# EAGLE design LMG1025_Flasher_Shield (EAGLE 9.6.0)

## Sheet 1 of 2
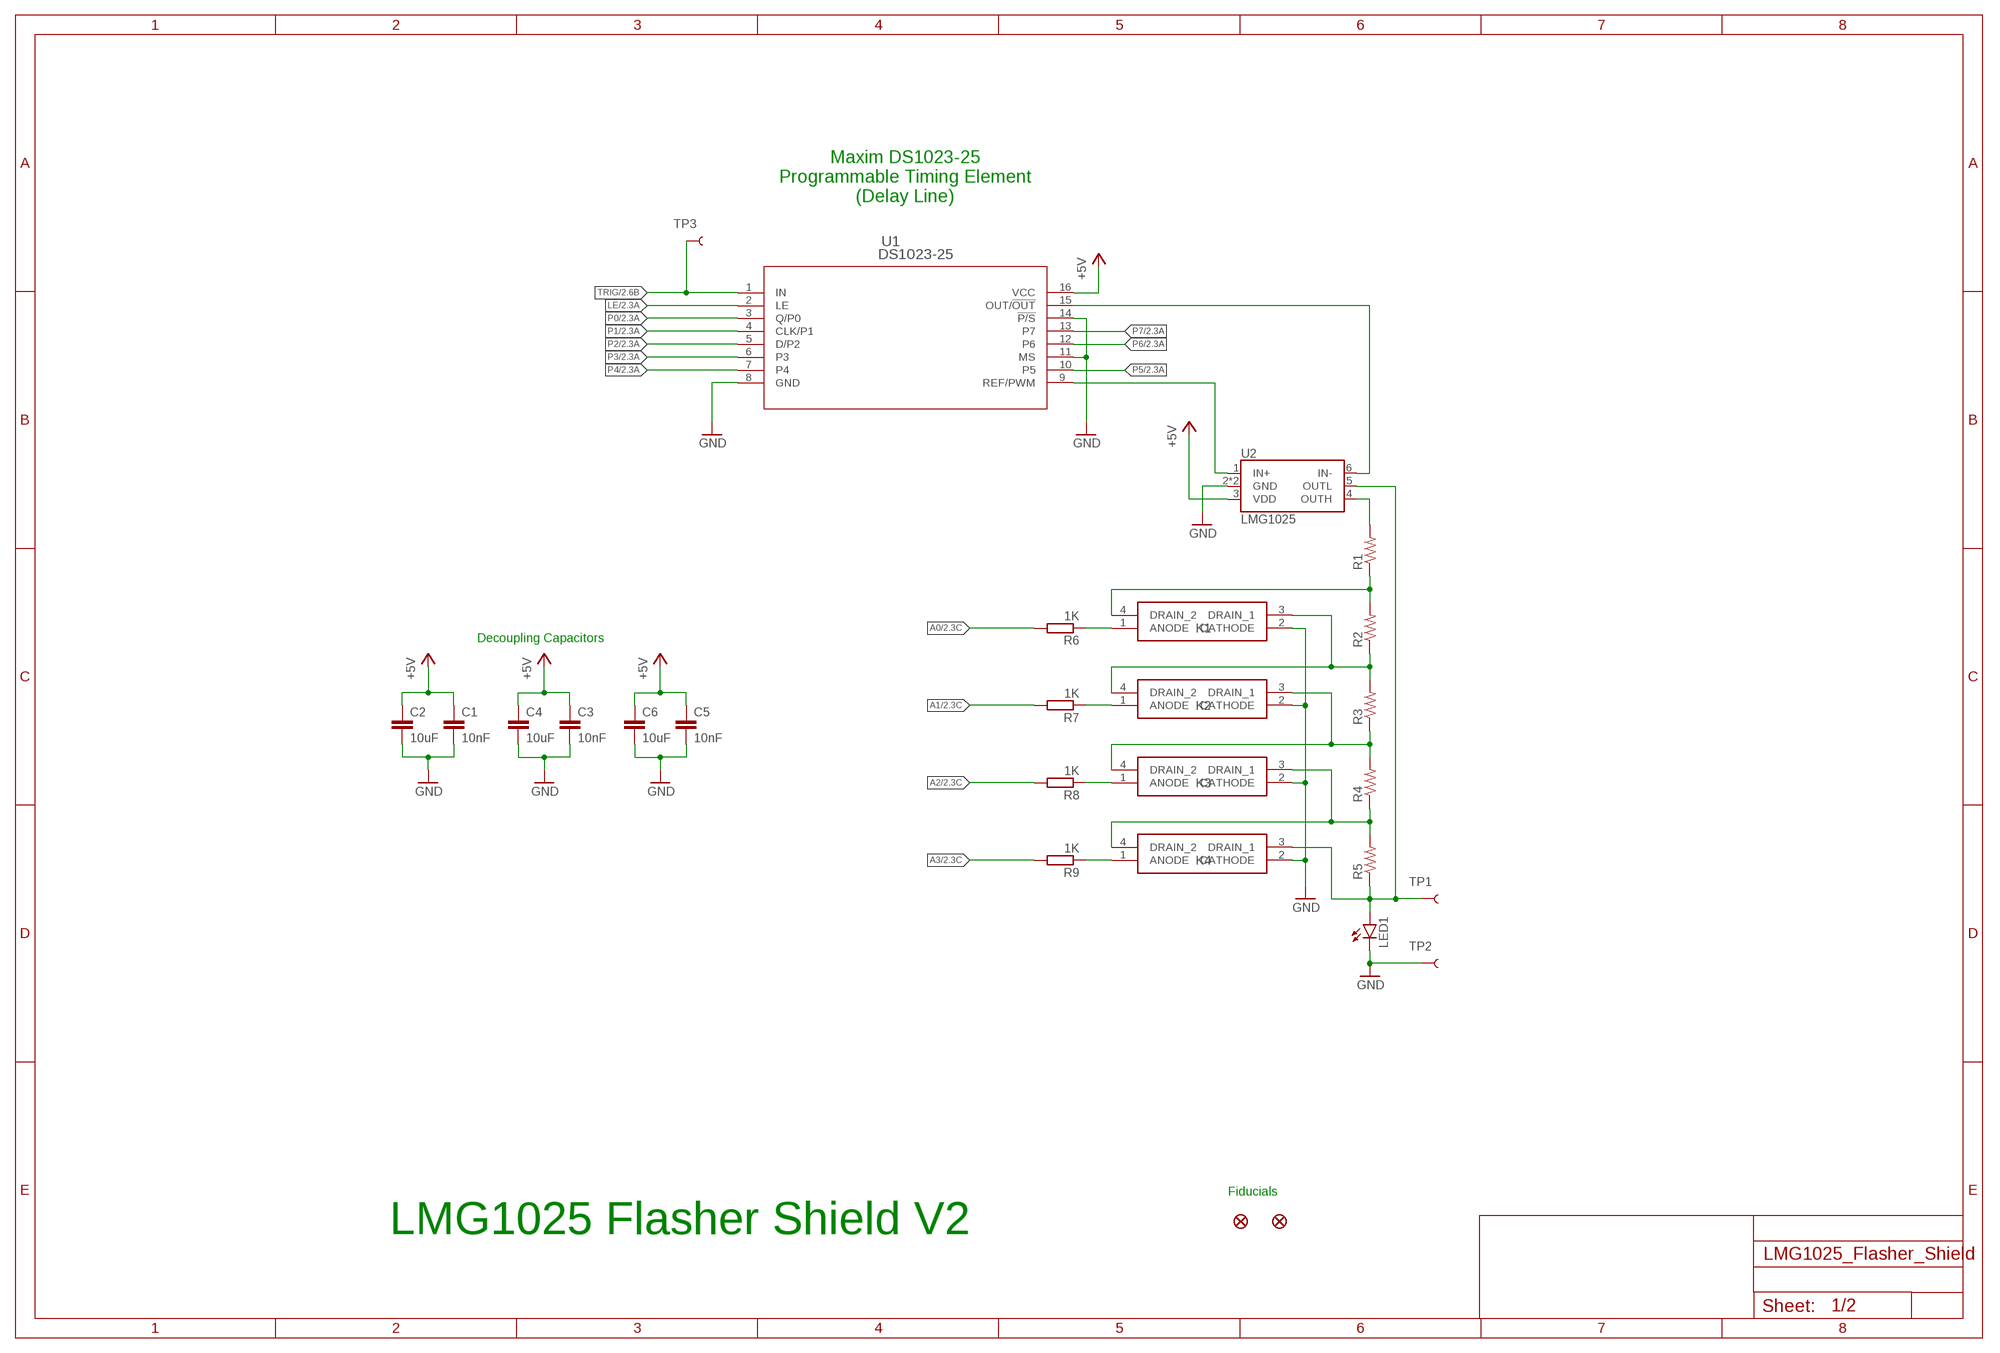
[diagram p0: schematic, sheet 1]

### Parts
C1  10nF  C-EUC0805  [C0805]
C2  10uF  C-EUC0805  [C0805]
C3  10nF  C-EUC0805  [C0805]
C4  10uF  C-EUC0805  [C0805]
C5  10nF  C-EUC0805  [C0805]
C6  10uF  C-EUC0805  [C0805]
FD1  FIDUCIAL1X2  [FIDUCIAL-1X2]
FD2  FIDUCIAL1X2  [FIDUCIAL-1X2]
K1  TLP3475R(TP,F  [TLP3475RTPF]
K2  TLP3475R(TP,F  [TLP3475RTPF]
K3  TLP3475R(TP,F  [TLP3475RTPF]
K4  TLP3475R(TP,F  [TLP3475RTPF]
LED1  LED3MM  [LED3MM]
R1  RESISTOR0805-RES  [0805]
R2  RESISTOR0805-RES  [0805]
R3  RESISTOR0805-RES  [0805]
R4  RESISTOR0805-RES  [0805]
R5  RESISTOR0805-RES  [0805]
R6  1K  R-EU_R0603  [R0603]
R7  1K  R-EU_R0603  [R0603]
R8  1K  R-EU_R0603  [R0603]
R9  1K  R-EU_R0603  [R0603]
TP1  TEST-POINTPOGO_PTH  [1X01_NO_SILK]
TP2  TEST-POINTPOGO_PTH  [1X01_NO_SILK]
TP3  TEST-POINTPOGO_PTH  [1X01_NO_SILK]
U1  DS1023-25  [21-0042B_16]
U2  LMG1025  [LMG1025]

### Nets
+5V: C1.1 C2.1 C3.1 C4.1 C5.1 C6.1 U1.16(VCC) U2.3(VDD) ; also sheet 2
A0: R6.2 ; also sheet 2
A1: R7.2 ; also sheet 2
A2: R8.2 ; also sheet 2
A3: R9.2 ; also sheet 2
GND: C1.2 C2.2 C3.2 C4.2 C5.2 C6.2 K1.2(CATHODE) K2.2(CATHODE) K3.2(CATHODE) K4.2(CATHODE) LED1.K(C) TP2.1 U1.8(GND) U1.11(MS) U1.14(!P/S) U2.2(GND) U2.PAD(GND) ; also sheet 2
LE: U1.2(LE) ; also sheet 2
N$1: K1.4(DRAIN_2) R1.1 R2.2
N$2: K1.3(DRAIN_1) K2.4(DRAIN_2) R2.1 R3.2
N$3: K4.3(DRAIN_1) LED1.A R5.1 TP1.1 U2.5(OUTL)
N$4: K2.3(DRAIN_1) K3.4(DRAIN_2) R3.1 R4.2
N$5: K3.3(DRAIN_1) K4.4(DRAIN_2) R4.1 R5.2
N$6: R1.2 U2.4(OUTH)
N$7: K1.1(ANODE) R6.1
N$8: K2.1(ANODE) R7.1
N$9: K3.1(ANODE) R8.1
N$10: K4.1(ANODE) R9.1
N$27: U1.9(REF/PWM) U2.1(IN+)
N$30: U1.15(OUT/!OUT) U2.6(IN-)
P0: U1.3(Q/P0) ; also sheet 2
P1: U1.4(CLK/P1) ; also sheet 2
P2: U1.5(D/P2) ; also sheet 2
P3: U1.6(P3) ; also sheet 2
P4: U1.7(P4) ; also sheet 2
P5: U1.10(P5) ; also sheet 2
P6: U1.12(P6) ; also sheet 2
P7: U1.13(P7) ; also sheet 2
TRIG: TP3.1 U1.1(IN) ; also sheet 2

### Notes on the sheet
- Maxim DS1023-25
  Programmable Timing Element
  (Delay Line)
- Decoupling Capacitors
- Fiducials
- LMG1025 Flasher Shield V2

## Sheet 2 of 2
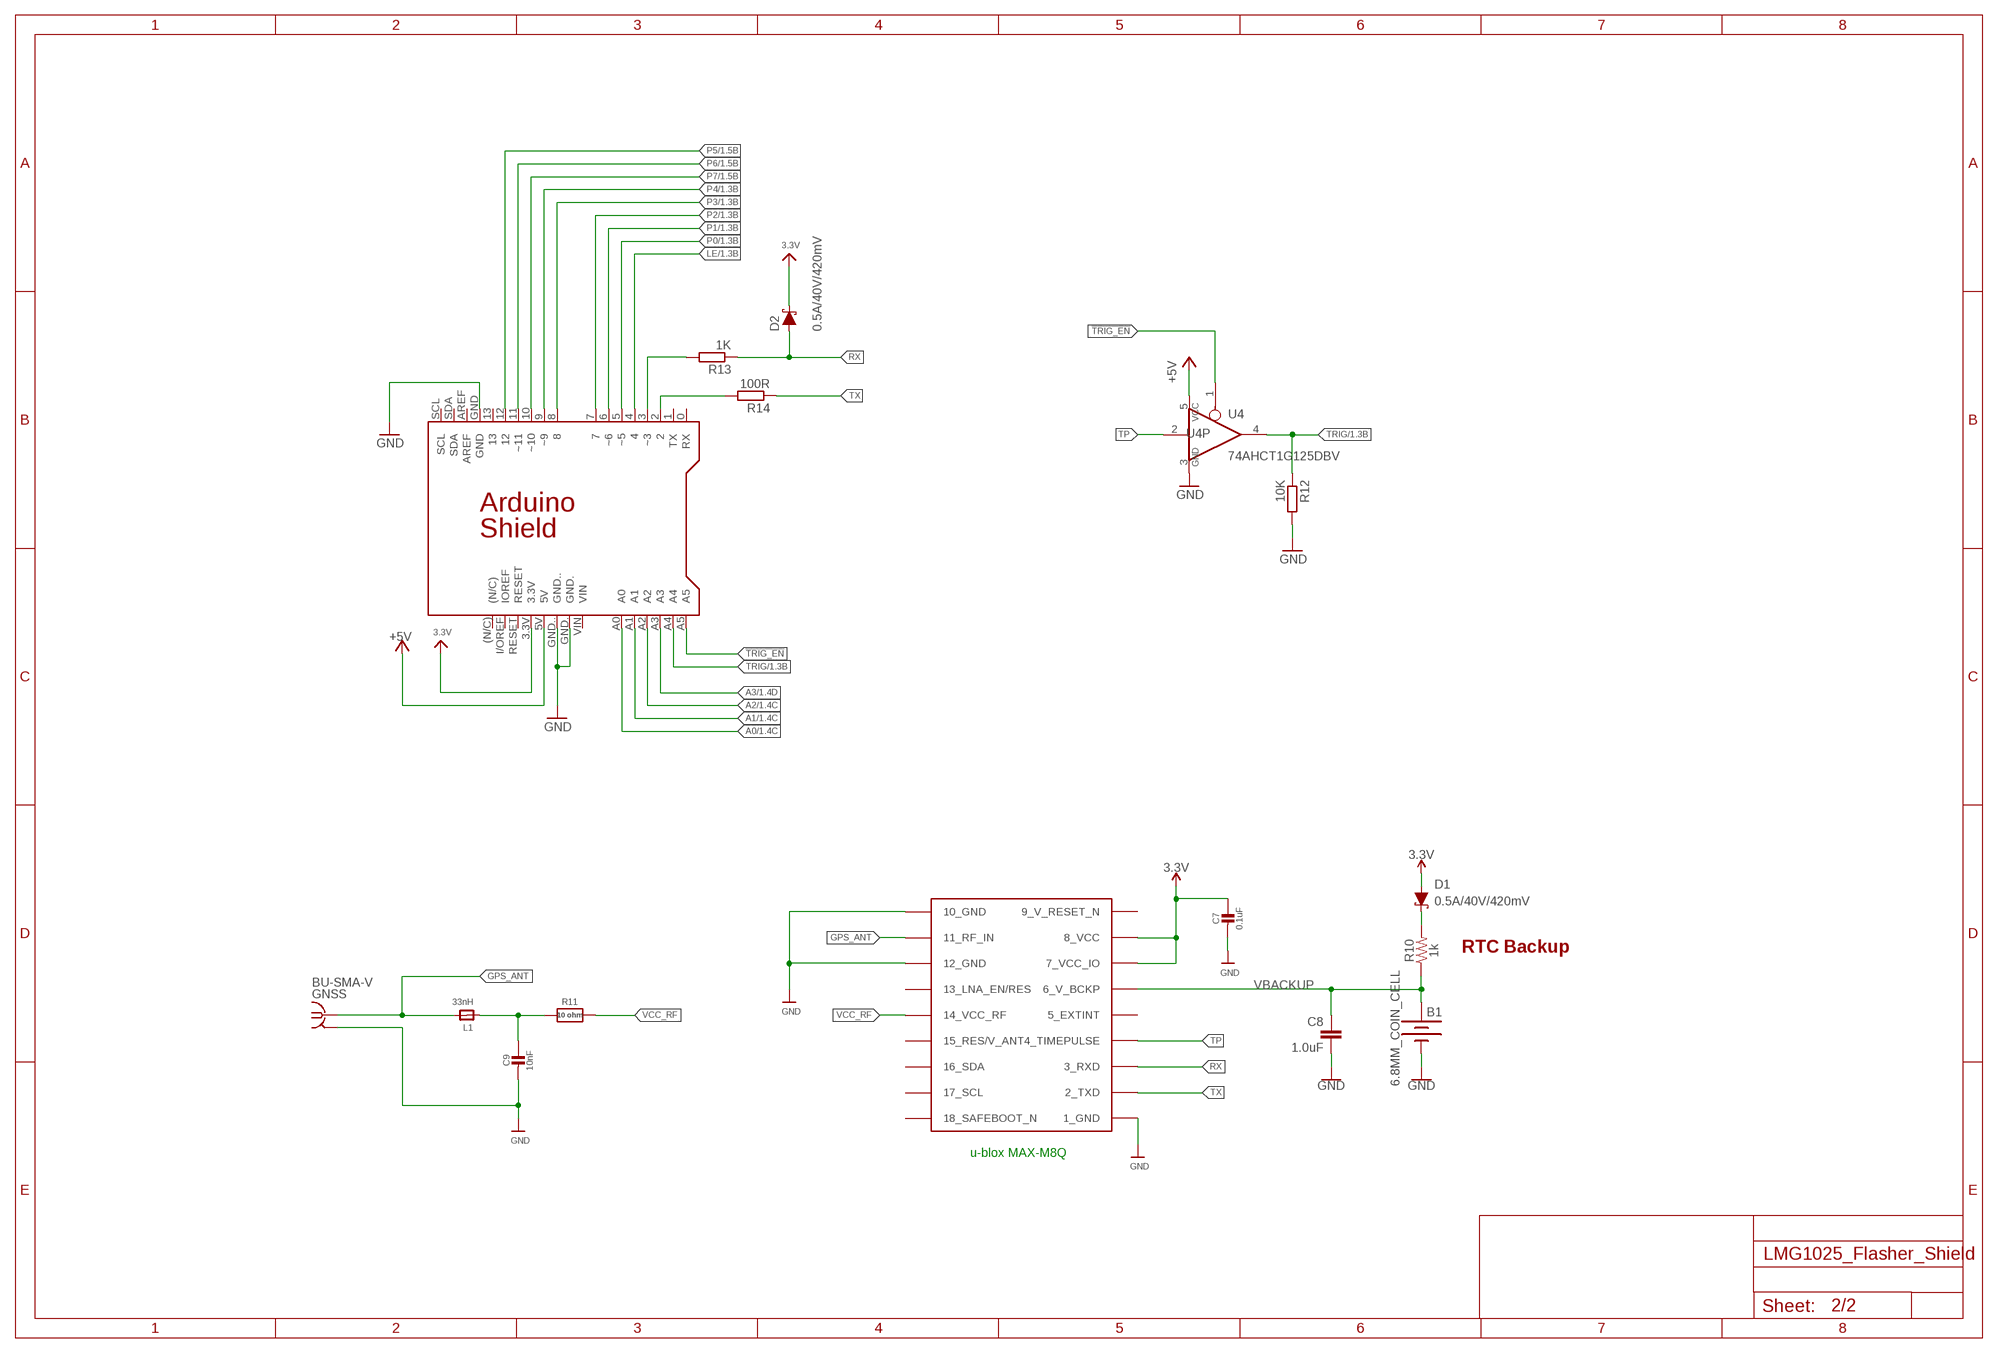
[diagram p1: schematic, sheet 2]

### Parts
B1  6.8MM_COIN_CELL  BATTERY-6.8MM_SMD  [BATTCON-6.8MM]
C7  0.1uF  CAP_CERAMIC0805-NOOUTLINE  [0805-NO]
C8  1.0uF  1.0UF-0603-16V-10%  [0603]
C9  10nF  CAP_CERAMIC0805-NOOUTLINE  [0805-NO]
D1  0.5A/40V/420mV  DIODE-SCHOTTKY-PMEG4005EJ  [SOD-323]
D2  0.5A/40V/420mV  DIODE-SCHOTTKY-PMEG4005EJ  [SOD-323]
GNSS  BU-SMA-V  [BU-SMA-V]
L1  33nH  FERRITE-0805NO  [0805-NO]
PCB1  CHEC_LED_DRIVER_SHIELD  [CHEC_LED_DRIVER_SHIELD]
R10  1k  1KOHM-0603-1/10W-1%  [0603@1]
R11  10 ohm  RESISTOR0805_NOOUTLINE  [0805-NO]
R12  10K  R-EU_R0603  [R0603]
R13  1K  R-EU_R0603  [R0603]
R14  100R  R-EU_R0603  [R0603]
U3  MAX-M8  [MAX-M8]
U4  74AHCT1G125DBV  [SOT23-5]

### Nets
3.3V: C7.1 D1.A D2.C PCB1.3.3V U3.7_VCC_IO U3.8_VCC
!TRIG_EN: PCB1.A5 U4.1(OE)
+5V: PCB1.5V U4.5(VCC) ; also sheet 1
A0: PCB1.A0 ; also sheet 1
A1: PCB1.A1 ; also sheet 1
A2: PCB1.A2 ; also sheet 1
A3: PCB1.A3 ; also sheet 1
GND: B1.- C7.2 C8.2 C9.2 GNSS.2 GNSS.3 GNSS.4 GNSS.5 PCB1.GND PCB1.GND. PCB1.GND.. R12.2 U3.1_GND U3.10_GND U3.12_GND U4.3(GND) ; also sheet 1
GPS_ANT: GNSS.1 L1.2 U3.11_RF_IN
LE: PCB1.4 ; also sheet 1
N$14: PCB1.3(~3) R13.2
N$15: C9.1 L1.1 R11.1
N$18: D1.C R10.2
N$21: PCB1.2 R14.2
P0: PCB1.5(~5) ; also sheet 1
P1: PCB1.6(~6) ; also sheet 1
P2: PCB1.7 ; also sheet 1
P3: PCB1.8 ; also sheet 1
P4: PCB1.9(~9) ; also sheet 1
P5: PCB1.12 ; also sheet 1
P6: PCB1.11(~11) ; also sheet 1
P7: PCB1.10(~10) ; also sheet 1
RX: D2.A R13.1 U3.3_RXD
TP: U3.4_TIMEPULSE U4.2(I)
TRIG: PCB1.A4 R12.1 U4.4(O) ; also sheet 1
TX: R14.1 U3.2_TXD
VBACKUP: B1.+ C8.1 R10.1 U3.6_V_BCKP
VCC_RF: R11.2 U3.14_VCC_RF
Unconnected: PCB1.0(RX) PCB1.1(TX) PCB1.13 PCB1.(N/C) PCB1.AREF PCB1.I/OREF(IOREF) PCB1.RESET PCB1.SCL PCB1.SDA PCB1.VIN U3.5_EXTINT U3.13_LNA_EN(13_LNA_EN/RES) U3.15_V_ANT/RESERVED(15_RES/V_ANT) U3.16_SDA U3.17_SCL U3.18_SAFEBOOT_N

### Notes on the sheet
- RTC Backup
- u-blox MAX-M8Q

## Power pins joined to a net without a drawn wire
9_V_RESET_N: U3.9_RESET_N(9_V_RESET_N)

## Library data of the parts
B1 = SparkFun-Batteries:BATTERY: Battery - Single Cell A variety of battery chemistries, sizes, and footprints. Device List: 20MM_PTH - Coin Cell Battery Holder - 20mm (PTH) <https://www.sparkfun.com/products/783> 20MM_PTH_KIT- Coin Cell battery Holder - 20 mm (PTH) <http://www.sparkfun.com/products/783>kit version with special mask 6.8MM_PTH - Coin Cell Battery Holder - 6.8MM(SMD) <https://www.digikey.com/product-detail/en/seiko-instruments/MS621FE-FL11E/728-1057-ND/1889208?WT.srch=1&gclid=CNOQ5a6LzdQCFZS2wAodXCkE0g> 12MM_SMD - Coin Cell Battery Holder - 12mm (SMD) <https://www.sparkfun.com/products/10592> 12MM_PTH - Coin Cell Battery Holder - 12mm (PTH) <https://www.sparkfun.com/products/7948> 20MM_SMD - 20mm Coin Cell Battery Holder (SMD) (2 legs) Used on the Big Time Watch Kit <https://www.sparkfun.com/products/11734> 20MM_SMD_4LEGS - Coin Cell Battery Holder - 20mm (SMD) <https://www.sparkfun.com/products/11892> 20MM_SMD_4LEGS_OVERPASTE - Coin Cell Battery Holder - 20mm (SMD) <https://www.sparkfun.com/products/11892> (Over-paste on the legs) 24.5MM_PTH - Coin Cell Battery Holder - 24.5mm (PTH) <https://www.sparkfun.com/products/8863> 9V - 9V Battery Holder - PC Mount Used on the SparkFun SparkPunk Sound Kit <https://www.sparkfun.com/products/11177> and SparkFun SparkPunk Sequencer Kit <https://www.sparkfun.com/products/12707> 18650 - Battery Holder - 18650 (PTH) <https://www.sparkfun.com/products/13113> AA - Battery Holder - 1xAA (PTH) <https://www.sparkfun.com/products/7949> AAA - Battery Holder - 1xAAA (PTH) <https://www.sparkfun.com/products/12718> AA_KIT - Battery Holder - 1xAA (PTH) <https://www.sparkfun.com/products/7949> Special kit package - pads only have exposed copper on one side of the board. AAA_KIT - Battery Holder - 1xAAA (PTH) <https://www.sparkfun.com/products/12718> Special kit package - pads only have exposed copper on one side of the board.; PROD_ID: BATT-13734
C1-C6 = rcl:C-EU: CAPACITOR, European symbol; SPICEPREFIX: C
C7 C9 = microbuilder:CAP_CERAMIC: Ceramic Capacitors For new designs, use the packages preceded by an '_' character since they are more reliable: The following footprints should be used on most boards: _0402 - Standard footprint for regular board layouts _0603 - Standard footprint for regular board layouts _0805 - Standard footprint for regular board layouts _1206 - Standard footprint for regular board layouts For extremely tight-pitch boards where space is at a premium, the following 'micro-pitch' footprints can be used (smaller pads, no silkscreen outline, etc.): _0402MP - Micro-pitch footprint for very dense/compact boards _0603MP - Micro-pitch footprint for very dense/compact boards _0805MP - Micro-pitch footprint for very dense/compact boards _1206MP - Micro-pitch footprint for very dense/compact boards
C8 = SparkFun-Capacitors:1.0UF: 1µF ceramic capacitors A capacitor is a passive two-terminal electrical component used to store electrical energy temporarily in an electric field.; PROD_ID: CAP-00868
D1 D2 = SparkFun-DiscreteSemi:DIODE-SCHOTTKY: Schottky diode A Schottky diode is a semiconductor diode which has a low forward voltage drop and a very fast switching action.; PROD_ID: DIO-10955
FD1 FD2 = SparkFun-Aesthetics:FIDUCIAL: Fiducial Alignment Points Various fiducial points for machine vision alignment.
GNSS = con-coax:BU-SMA-V: FEMALE SMA CONNECTOR Radiall distributor RS 112-3794; OC_FARNELL: unknown; OC_NEWARK: unknown
K1-K4 = SamacSys_Parts:TLP3475R(TP,F: Solid State Relays - PCB Mount Photo-IC 3mA 50V 5000Vrms Source: Datasheet <http://toshiba.semicon-storage.com/info/docget.jsp?did=55304&prodName=TLP3475R>; DESCRIPTION: Solid State Relays - PCB Mount Photo-IC 3mA 50V 5000Vrms; HEIGHT: 1mm; MANUFACTURER_NAME: Toshiba; MANUFACTURER_PART_NUMBER: TLP3475R(TP,F; MOUSER_PART_NUMBER: 757-TLP3475RTPF; MOUSER_PRICE-STOCK: https://www.mouser.com/Search/Refine.aspx?Keyword=757-TLP3475RTPF
L1 = microbuilder:FERRITE: Ferrite Bead 0603 MMZ1608B121C - 120 Ohm @ 100MHz, 600mA, 0.15 Ohm DC Resistance - Digikey: 445-2164-1-ND BK1608HW121-T - 120 Ohm, 600mA Ferrite Chip - Digikey: 587-1876-2-ND 0805 HZ0805B272R-10 - 2.7K Ohm @ 100MHz, 200mA, 0.8 Ohm DC Resistance - Digikey: 240-2504-1-ND (see also Murata BLM21BD272SN1L) MMZ2012Y152B - 1.5K Ohm @ 100MHz, 500mA, 0.4 Ohm DC Resistance - Digikey: 445-1560-1-ND - Mainly for high frequency (80-400MHz) MMZ2012R102A - 1K Ohm @ 100MHz, 500mA, 0.3 Ohm DC Resistance - Digikey: 445-1555-2-ND - More general purpose (10-200MHz)
LED1 = SparkFun-LED:LED: LEDs Standard schematic elements and footprints for 5mm, 3mm, 1206, and 0603 sized LEDs. 5mm - Spark Fun Electronics SKU : COM-00529 (and others); PROD_ID: DIO-08794
PCB1 = LMG1025_Flasher_Shield:CHEC_LED_DRIVER_SHIELD: CHEC LED Driver Shield for Arduino Leonardo Ethernet
R1-R5 = SparkFun-Resistors:RESISTOR: Resistor Basic schematic elements and footprints for 0603, 1206, and PTH resistors.
R6-R9 R12-R14 = resistor:R-EU_: RESISTOR, European symbol
R10 = SparkFun-Resistors:1KOHM: 1kΩ resistor A resistor is a passive two-terminal electrical component that implements electrical resistance as a circuit element. Resistors act to reduce current flow, and, at the same time, act to lower voltage levels within circuits. - Wikipedia; PROD_ID: RES-07856
R11 = microbuilder:RESISTOR: Resistors For new designs, use the packages preceded by an '_' character since they are more reliable: The following footprints should be used on most boards: _0402 - Standard footprint for regular board layouts _0603 - Standard footprint for regular board layouts _0805 - Standard footprint for regular board layouts _1206 - Standard footprint for regular board layouts For extremely tight-pitch boards where space is at a premium, the following 'micro-pitch' footprints can be used (smaller pads, no silkscreen outline, etc.): _0402MP - Micro-pitch footprint for very dense/compact boards _0603MP - Micro-pitch footprint for very dense/compact boards _0805MP - Micro-pitch footprint for very dense/compact boards _1206MP - Micro-pitch footprint for very dense/compact boards
TP1-TP3 = SparkFun-Connectors:TEST-POINT: SparkFun Test Points Bare copper test points for troubleshooting or In-Circuit-Testing. These are used by our Production team for verifying production board runs using pogo-pins on test beds. SparkFun Products: SparkFun LSM9DS1 Breakout <https://www.sparkfun.com/products/13284> SparkFun PSOC <https://www.sparkfun.com/products/13714> SparkFun Load Cell Amplifier <https://www.sparkfun.com/products/13879>
U1 = DS1023:DS1023-25; MANUFACTURER_PART_NUMBER: DS102325; VENDOR: MAXIM
U2 = LMG1025:LMG1025: Texas Instruments LMG1025-Q1 Automotive Low Side GaN and MOSFET Driver For High Frequency and Narrow Pulse Applications
U3 = ubloxLib:MAX-M8: u-blox MAX GNSS module
U4 = 74xx-little-us:74*1G125: Single Bus Buffer Gate with 3-State Output

## Board
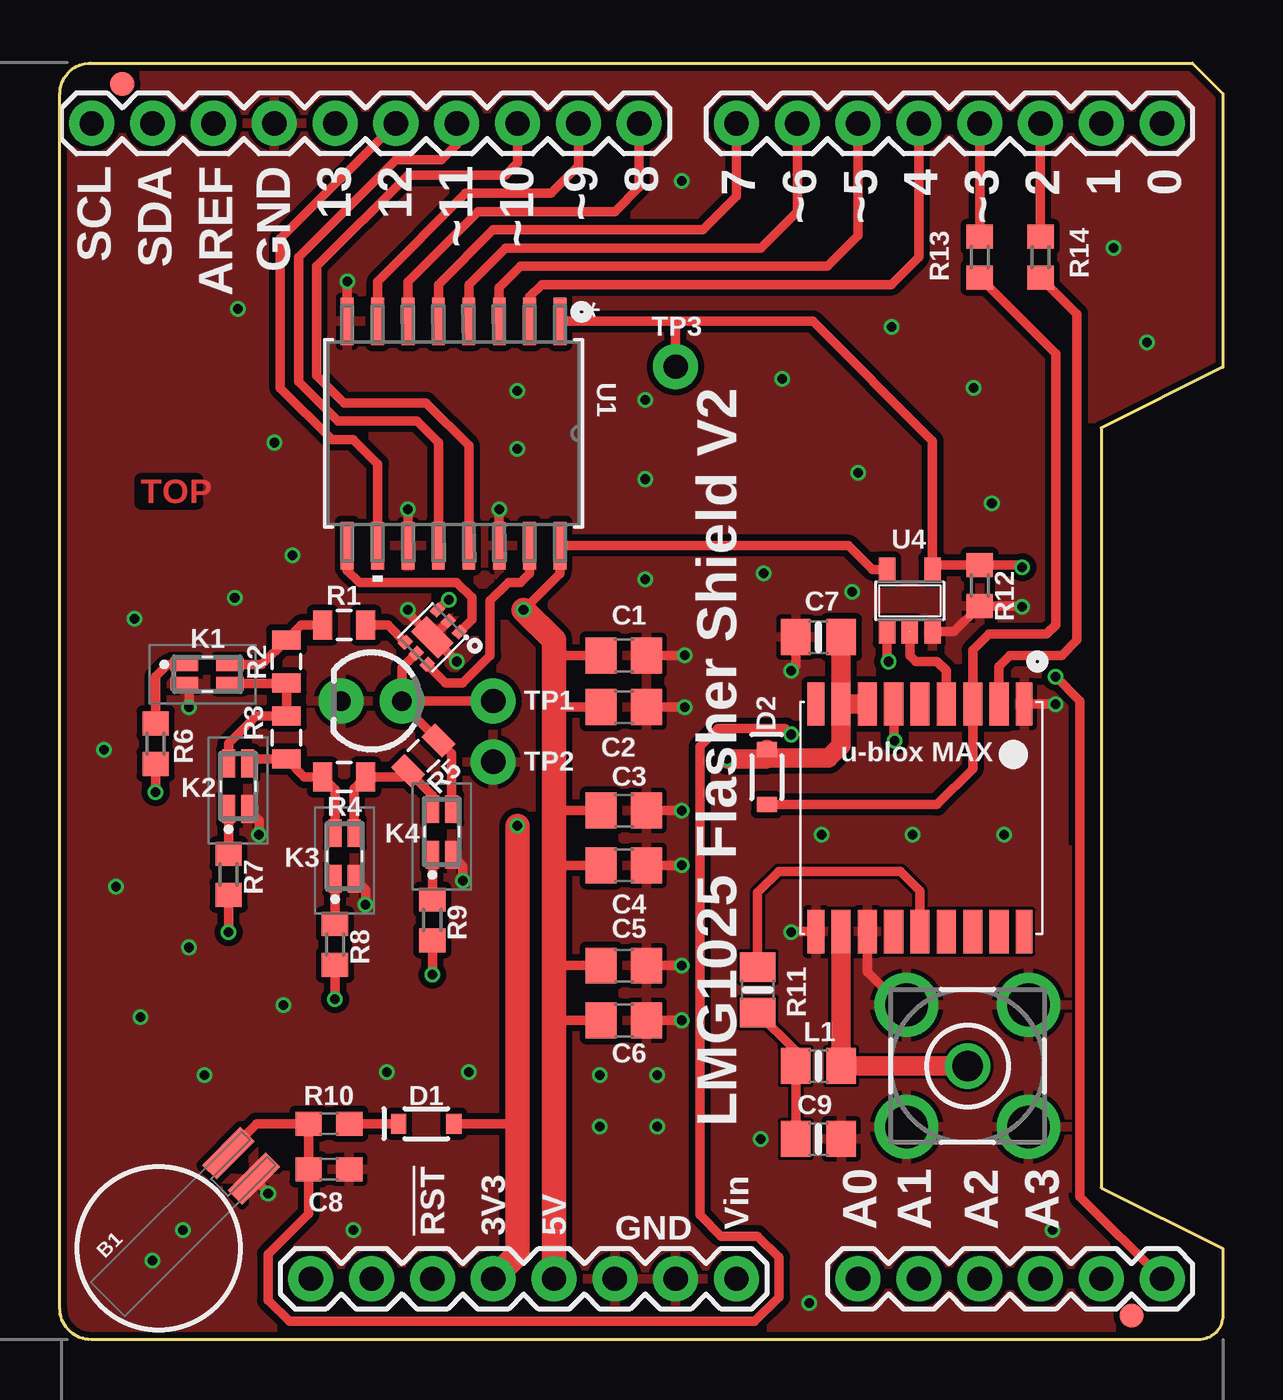
[diagram p2: board, top side]
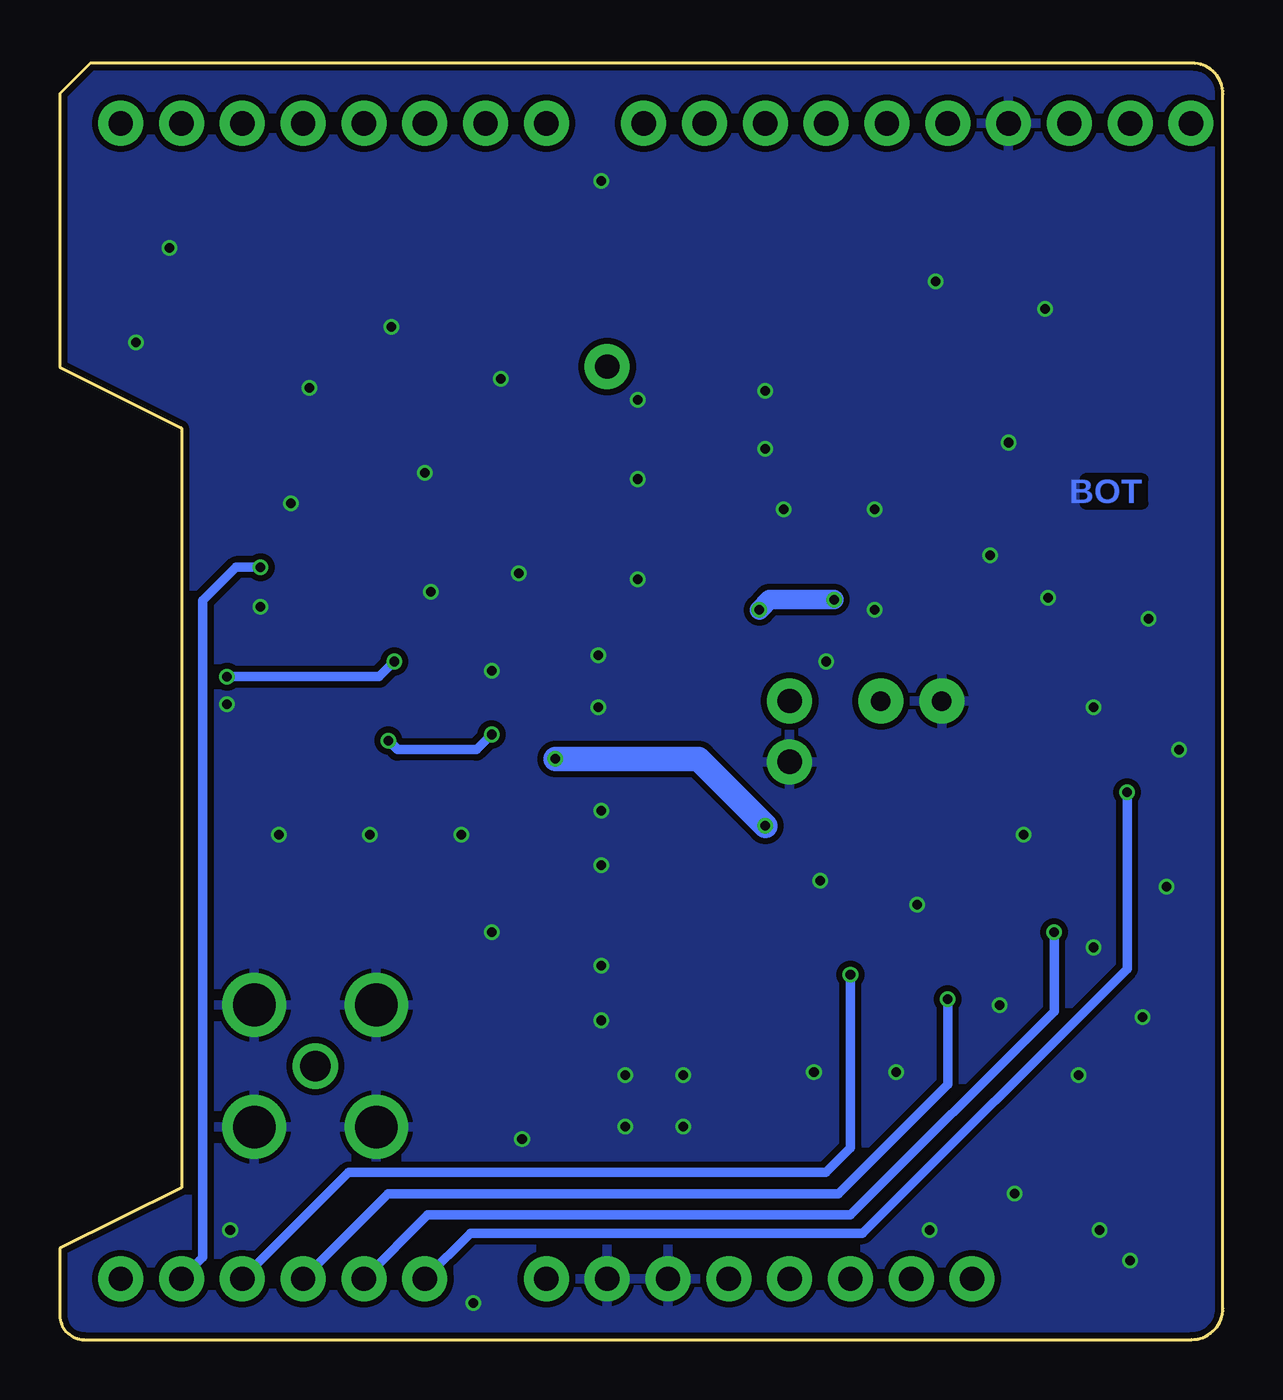
[diagram p3: board, bottom side, seen from below]

Size 48.58 x 53.31 mm. Coordinates in mm from the lower left corner, seen from the top.
Copper layers (1*16): Top 0.018mm / dielectric 1.55mm / Bottom 0.018mm
Design rules "Multi-CB_4L_125um-Tracks_OL35um-IL35um *": minimum track width 0.125mm, minimum drill 0.2mm, track to track 0.125mm, track to pad 0.125mm, pad to pad 0.125mm, via to via 0.125mm, smd to smd 0mil, copper to edge 0.2mm, drill to drill 0.2mm, minimum pad ring 0.125mm, minimum via ring 0.125mm, stop-mask expansion 2mil, vias tented up to drill 0.45mm, thermal gap 0.2mm

### Footprints (pad centres in the part's own frame; a part is rotated, then mirrored left to right if it is on the bottom)
BATTCON-6.8MM = smd 2.25 x 0.85: + 4.87,0.75; - 4.87,-0.75
C0805 = smd 1.3 x 1.5: 1 -0.95,0; 2 0.95,0
0805-NO = smd 1.24 x 1.5: 1 -0.95,0; 2 0.95,0
0603 = smd 1.1 x 1: 1 -0.85,0; 2 0.85,0
SOD-323 = smd 0.63 x 0.83: A 1.15,0; C -1.15,0
FIDUCIAL-1X2 = smd 1 x 1: 1 0,0
BU-SMA-V = drill 1.27: 1 0,0 | drill 1.778: 2 -2.55,2.55; 3 2.55,2.55; 4 2.55,-2.55; 5 -2.55,-2.55
TLP3475RTPF = smd 0.55 x 1.15: 1 0,-0.95; 2 0.8,-0.95; 3 0.8,0.95; 4 0,0.95
LED3MM = drill 0.813 pad 1.88: A -1.27,0; K 1.27,0
CHEC_LED_DRIVER_SHIELD = drill 1.016 pad 1.88: 0 45.72,50.8; 1 43.18,50.8; 2 40.64,50.8; 3 38.1,50.8; 3.3V 17.78,2.54; 4 35.56,50.8; 5 33.02,50.8; 5V 20.32,2.54; 6 30.48,50.8; 7 27.94,50.8; 8 23.876,50.8; 9 21.336,50.8; 10 18.796,50.8; 11 16.256,50.8; 12 13.716,50.8; 13 11.176,50.8; (N/C) 10.16,2.54; A0 33.02,2.54; A1 35.56,2.54; A2 38.1,2.54; A3 40.64,2.54; A4 43.18,2.54; A5 45.72,2.54; AREF 6.096,50.8; GND 8.636,50.8; GND. 25.4,2.54; GND.. 22.86,2.54; I/OREF 12.7,2.54; RESET 15.24,2.54; SCL 1.016,50.8; SDA 3.556,50.8; VIN 27.94,2.54
0805 = smd 0.8 x 1.2: 1 -0.9,0; 2 0.9,0
R0603 = smd 1 x 1.1: 1 -0.85,0; 2 0.85,0
0603@1 = smd 1.1 x 1: 1 -0.85,0; 2 0.85,0
1X01_NO_SILK = drill 1.016 pad 1.88: 1 0,0
21-0042B_16 = smd 1.981 x 0.533: 1 -4.686,4.445; 2 -4.686,3.175; 3 -4.686,1.905; 4 -4.686,0.635; 5 -4.686,-0.635; 6 -4.686,-1.905; 7 -4.686,-3.175; 8 -4.686,-4.445; 9 4.686,-4.445; 10 4.686,-3.175; 11 4.686,-1.905; 12 4.686,-0.635; 13 4.686,0.635; 14 4.686,1.905; 15 4.686,3.175; 16 4.686,4.445
LMG1025 = smd 0.4 x 0.5: 1 -0.65,-0.95; 2 0,-0.95; 3 0.65,-0.95; 4 0.65,0.95; 5 0,0.95; 6 -0.65,0.95 | smd 1.6 x 0.9: PAD 0,0
MAX-M8 = smd 1.8 x 0.7: 1_GND 4.95,-4.4; 9_RESET_N 4.95,4.3; 10_GND -4.55,4.3; 18_SAFEBOOT_N -4.55,-4.4 | smd 1.8 x 0.8: 2_TXD 4.95,-3.35; 3_RXD 4.95,-2.25; 4_TIMEPULSE 4.95,-1.15; 5_EXTINT 4.95,-0.05; 6_V_BCKP 4.95,1.05; 7_VCC_IO 4.95,2.15; 8_VCC 4.95,3.25; 11_RF_IN -4.55,3.25; 12_GND -4.55,2.15; 13_LNA_EN -4.55,1.05; 14_VCC_RF -4.55,-0.05; 15_V_ANT/RESERVED -4.55,-1.15; 16_SDA -4.55,-2.25; 17_SCL -4.55,-3.35
SOT23-5 = smd 0.69 x 0.99: 1 -0.95,-1.29; 2 0,-1.29; 3 0.95,-1.29; 4 0.95,1.3; 5 -0.95,1.3

### Placement (x,y rotation side)
B1  4.13,3.81 45 top
C1  23.56,28.57 0 top
C2  23.56,26.42 0 top
C3  23.56,22.1 0 top
C4  23.56,19.81 0 top
C5  23.56,15.62 0 top
C6  23.56,13.34 0 top
C7  31.69,29.34 180 top
C8  11.24,7.11 0 top
C9  31.69,8.38 0 top
D1  15.3,9.02 0 top
D2  29.53,23.5 270 top
FD1  2.6,52.45 0 top
FD2  44.77,1.02 0 top
GNSS  37.91,11.43 0 top
K1  6.16,28.19 270 top
K2  7.05,23.11 0 top
K3  11.49,20.19 0 top
K4  15.56,21.21 0 top
L1  31.69,11.43 0 top
LED1  13.02,26.67 180 top
PCB1  0.32,0 0 top
R1  11.87,29.84 0 top
R2  9.46,28.32 90 top
R3  9.46,25.15 90 top
R4  11.87,23.5 180 top
R5  15.18,24.38 225 top
R6  4,24.89 270 top
R7  7.05,19.43 270 top
R8  11.49,16.51 270 top
R9  15.56,17.53 270 top
R10  11.24,9.02 0 top
R11  29.15,14.61 90 top
R12  38.42,31.5 270 top
R13  38.42,45.21 90 top
R14  40.96,45.21 90 top
TP1  18.1,26.67 0 top
TP2  18.1,24.13 0 top
TP3  25.72,40.64 0 top
U1  16.45,37.85 270 top
U2  15.56,29.34 135 top
U3  35.88,21.59 90 top
U4  35.5,30.86 0 top

### Tracks (layer width: path | path; a pad name or v marks a point on that pad's centre or on a via)
3.3V  (via drill 0.4)
  Top 0.406: D1.A 19.11,9.02
  Top 0.813: v27.88,24.26 29.49,24.26 29.53,24.3 | U3.8_VCC 32.63,24.82 32.11,24.3 29.53,24.3 | U3.7_VCC_IO U3.8_VCC | C7.1 32.63,29.33 U3.8_VCC | D2.C 29.53,24.3
  Top 1.016: PCB1.3.3V 19.11,3.56 19.11,9.02 v19.11,21.46
  Bottom 1.016: v27.88,24.26 21.91,24.26 v19.11,21.46
!TRIG_EN  (via drill 0.4)
  Top 0.406: PCB1.A5 42.61,5.97 42.61,26.67 v41.59,27.69 | v34.61,28.32 34.55,28.38 U4.1
  Bottom 0.406: v41.59,27.69 35.24,27.69 v34.61,28.32
+5V  (via drill 0.4)
  Top 0.406: U4.5 33.94,32.16 32.94,33.16 U1.16 20.89,32 v19.37,30.48 | U2.3 16.21,30.91 v16.24,30.91 | C2.1 20.64,26.42 | C1.1 20.64,28.57 | C3.1 20.64,22.1 | C4.1 20.64,19.81 | C5.1 20.64,15.62 | C6.1 20.64,13.34
  Top 1.016: PCB1.5V 20.64,13.34 20.64,15.62 20.64,19.81 20.64,22.1 20.64,26.42 20.64,28.57 20.64,29.21 v19.37,30.48
  Bottom 0.813: v19.37,30.48 18.94,30.91 v16.24,30.91
A0  (via drill 0.4)
  Top 0.406: v4,22.86 R6.2
  Bottom 0.406: PCB1.A0 31.43,4.45 15.05,4.45 4,15.49 v4,22.86
A1  (via drill 0.4)
  Top 0.406: v7.05,17.02 R7.2
  Bottom 0.406: PCB1.A1 33.21,5.21 15.56,5.21 7.05,13.72 v7.05,17.02
A2  (via drill 0.4)
  Top 0.406: v11.49,14.22 R8.2
  Bottom 0.406: PCB1.A2 34.86,6.1 16.07,6.1 11.49,10.67 v11.49,14.22
A3  (via drill 0.4)
  Top 0.406: v15.56,15.24 R9.2
  Bottom 0.406: PCB1.A3 36.51,6.99 16.57,6.99 15.56,8 v15.56,15.24
GND  (via drill 0.4)
  Top 0.406: U3.12_GND 33.73,15.36 35.11,13.98 GNSS.2 | U3.10_GND 30.57,17.04 v30.54,17.02 | U3.1_GND v41.59,26.54 | v40.2,30.61 40.16,30.65 R12.2 37.34,29.57 U4.3 | B1.- 8.7,6.12 v8.7,6.1 | C7.2 30.74,28.13 v30.54,27.94 | U2.2 U2.PAD | U2.PAD 14.54,30.35 v14.54,30.48 | v14.54,34.67 U1.11 | U1.14 v18.35,34.67 | v16.57,28.32 U2.PAD | U1.8 v12,44.2 | C1.2 v26.1,28.57 | C2.2 v26.1,26.42 | K1.2 5.4,27.21 v5.4,26.42 | K2.2 8.32,21.69 v8.32,21.08 | K3.2 12.76,18.77 v12.76,18.16 | K4.2 16.83,19.79 v16.83,19.18 | v25.97,22.1 C3.2 | v25.97,19.81 C4.2 | v25.97,15.62 C5.2 | v25.97,13.34 C6.2
  other vias: 31.81,21.08 35.62,21.08 39.43,21.08 33.08,31.24 3.87,3.3 5.14,4.57 29.27,8.38 6.03,11.05 3.37,13.46 2.35,18.92 1.84,24.64 3.11,30.1 7.3,30.99 9.72,32.77 8.95,37.47 7.43,43.05 25.97,48.39 34.73,42.29 38.16,39.75 38.93,34.92 19.11,39.62 19.11,37.21 24.45,39.24 30.16,40.13 33.34,36.2 24.45,31.75 29.4,32 24.45,35.94 22.54,11.05 24.96,11.05 22.54,8.89 24.96,8.89 9.33,13.97 5.4,16.38 13.65,11.18 17.08,11.18 12.26,4.57 41.47,4.57 44.01,45.59 45.4,41.66 31.31,1.52
  pour Top (isolate 0.102): 27.62,20.45 43.5,20.45 43.5,6.35 27.62,6.35
  pour Top (isolate 0.254, rank 2): 0.06,0 0.06,53.34 47.31,53.34 48.58,52.07 48.58,40.64 43.5,38.1 43.5,6.35 48.58,3.81 48.58,0
  pour Bottom (isolate 0.254, rank 2): 0.06,0 0.06,53.34 47.31,53.34 48.58,52.07 48.58,40.64 43.5,38.1 43.5,6.35 48.58,3.81 48.58,0
GPS_ANT
  Top 0.813: GNSS.1 L1.2 U3.11_RF_IN
LE
  Top 0.406: U1.2 19.62,43.56 20.13,44.07 34.73,44.07 35.88,45.21 PCB1.4
N$1
  Top 0.406: R1.1 10.09,29.84 R2.2 8.43,28.19 K1.4
N$2
  Top 0.406: K1.3 9.43,27.39 R2.1 R3.2 8.2,26.05 7.05,24.89 K2.4
N$3
  Top 0.406: LED1.A 14.29,26.55 R5.1 16.36,24.48 K4.3 | U2.5 14.29,28.07 LED1.A | TP1.1 LED1.A
N$4
  Top 0.406: K2.3 8.03,24.25 R3.1 10.21,23.5 R4.2 11.49,22.98 K3.4
N$5
  Top 0.406: K3.3 12.29,23.01 R4.1 14.29,23.5 R5.2 15.56,22.73 K4.4
N$6
  Top 0.406: U2.4 13.71,29.84 R1.2
N$7
  Top 0.406: R6.1 4,27.69 4.51,28.19 K1.1
N$8
  Top 0.406: R7.1 K2.1
N$9
  Top 0.406: R8.1 K3.1
N$10
  Top 0.406: R9.1 K4.1
N$14
  Top 0.406: R13.2 PCB1.3
N$15
  Top 0.406: C9.1 L1.1 30.74,12.06 R11.1
N$18
  Top 0.406: D1.C R10.2
N$21
  Top 0.406: R14.2 PCB1.2
N$27
  Top 0.406: U2.1 17.21,30.07 17.21,30.99 16.57,31.62 12.51,31.62 12,32.13 U1.9
N$30
  Top 0.406: U2.6 16.12,27.43 16.83,27.43 17.97,28.57 17.97,30.86 18.73,31.62 19.24,31.62 19.62,32 U1.15
P0
  Top 0.406: U1.3 18.35,43.94 19.24,44.83 32.07,44.83 33.34,46.1 PCB1.5
P1
  Top 0.406: U1.4 17.08,44.07 18.61,45.59 29.27,45.59 30.8,47.12 PCB1.6
P2
  Top 0.406: U1.5 15.81,44.07 18.1,46.35 26.86,46.35 28.26,47.75 PCB1.7
P3
  Top 0.406: U1.6 14.54,44.2 17.46,47.12 23.18,47.12 24.19,48.13 PCB1.8
P4
  Top 0.406: U1.7 13.27,44.2 16.95,47.88 20.51,47.88 21.65,49.02 PCB1.9
P5
  Top 0.406: U1.10 13.27,36.58 12.26,37.59 11.37,37.59 9.21,39.75 9.21,45.97 PCB1.12
P6
  Top 0.406: U1.12 15.81,37.47 14.92,38.35 11.62,38.35 9.97,40.01 9.97,45.21 14.03,49.28 15.94,49.28 16.57,49.91 PCB1.11
P7
  Top 0.406: U1.13 17.08,37.34 15.3,39.12 11.87,39.12 10.73,40.26 10.73,44.83 14.54,48.64 18.61,48.64 19.11,49.15 PCB1.10
RX
  Top 0.406: R13.1 41.59,41.19 41.59,29.84 41.21,29.46 38.8,29.46 38.13,28.79 U3.3_RXD 38.13,23.84 36.63,22.34 D2.A
TP
  Top 0.406: U4.2 35.5,28.57 35.75,28.32 36.64,28.32 37.02,27.94 U3.4_TIMEPULSE
TRIG  (via drill 0.4)
  Top 0.406: U1.1 25.72,42.53 | 25.72,42.53 31.45,42.53 36.45,37.53 U4.4 36.63,32.35 R12.1 40.11,32.35 v40.2,32.26 | TP3.1 25.72,42.53
  Bottom 0.406: v40.2,32.26 41.21,32.26 42.61,30.86 42.61,3.43 PCB1.A4
TX
  Top 0.406: R14.1 42.48,42.84 42.48,29.21 41.85,28.57 39.69,28.57 39.23,28.11 U3.2_TXD
VBACKUP  (via drill 0.4)
  Top 0.406: B1.+ 7.04,7.84 8.22,9.02 R10.1 C8.1 10.39,5.25 8.7,3.56 8.7,1.65 9.59,0.76 29.02,0.76 30.04,1.78 30.04,3.43 29.15,4.32 27.62,4.32 26.73,5.21 26.73,24.77 27.5,25.53 30.29,25.53 v30.54,25.27 | v34.86,25.02 34.83,25.05 U3.6_V_BCKP
  Bottom 0.406: v30.54,25.27 31.18,24.64 34.48,24.64 v34.86,25.02
VCC_RF
  Top 0.406: R11.2 29.15,18.67 30.04,19.56 35.12,19.56 35.93,18.75 U3.14_VCC_RF

### Text on the board
Top: TOP
Bottom: BOT
tNames: LMG1025 Flasher Shield V2